# Altium schematic sheet Sheet2.SchDoc
size 594 x 420 mm; PageSetup: Record=PageOptions|CenterHorizontal=True|CenterVertical=True|PrintScale=0.94|XCorrection=1.00|YCorrection=1.00|PrintKind=1|BorderSize=5000000|LeftOffset=0|BottomOffset=0|Orientation=1|PaperLength=1000|PaperWidth=1000|Scale=100|PaperSource=7|PrintQuality=-4|MediaType=1|DitherType=10|PaperKind=A4|PrintScaleMode=1; DecimalNumber: Децимальный номер; HeadOfSector: Нач. сектора; MainDevice: Перв.примен.; Name: Наименование
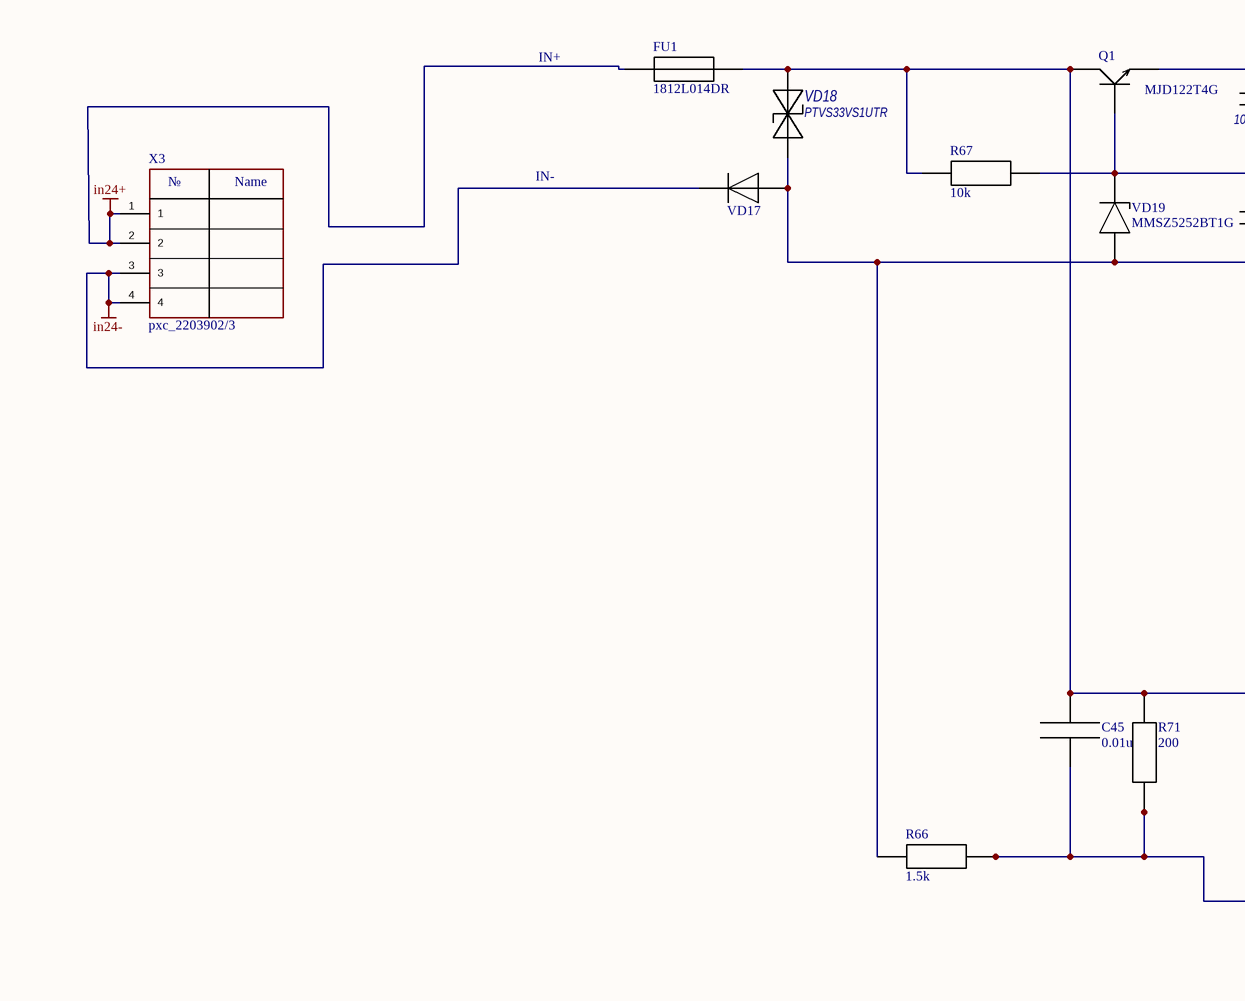
[diagram p0: Sheet2.SchDoc, top left]
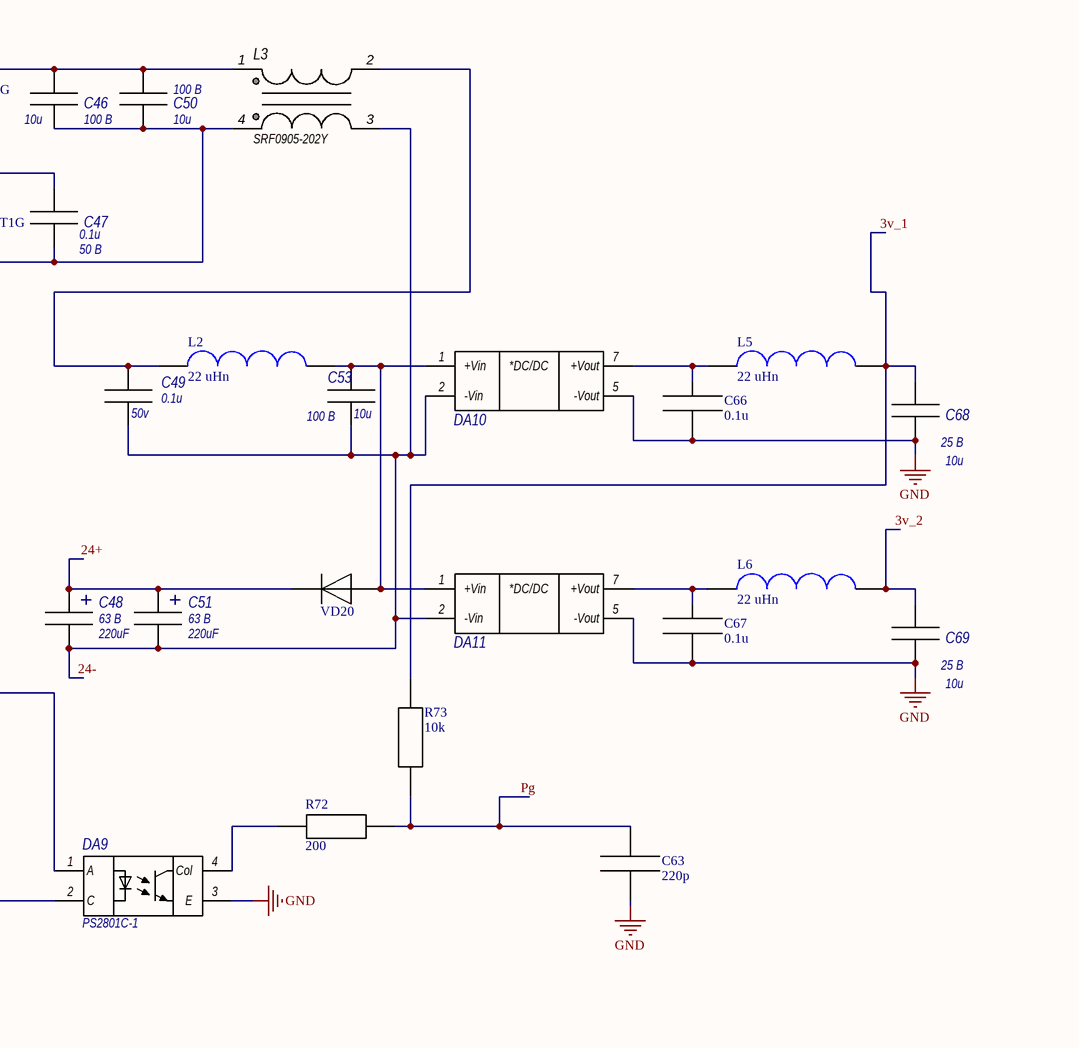
[diagram p1: Sheet2.SchDoc, top right]
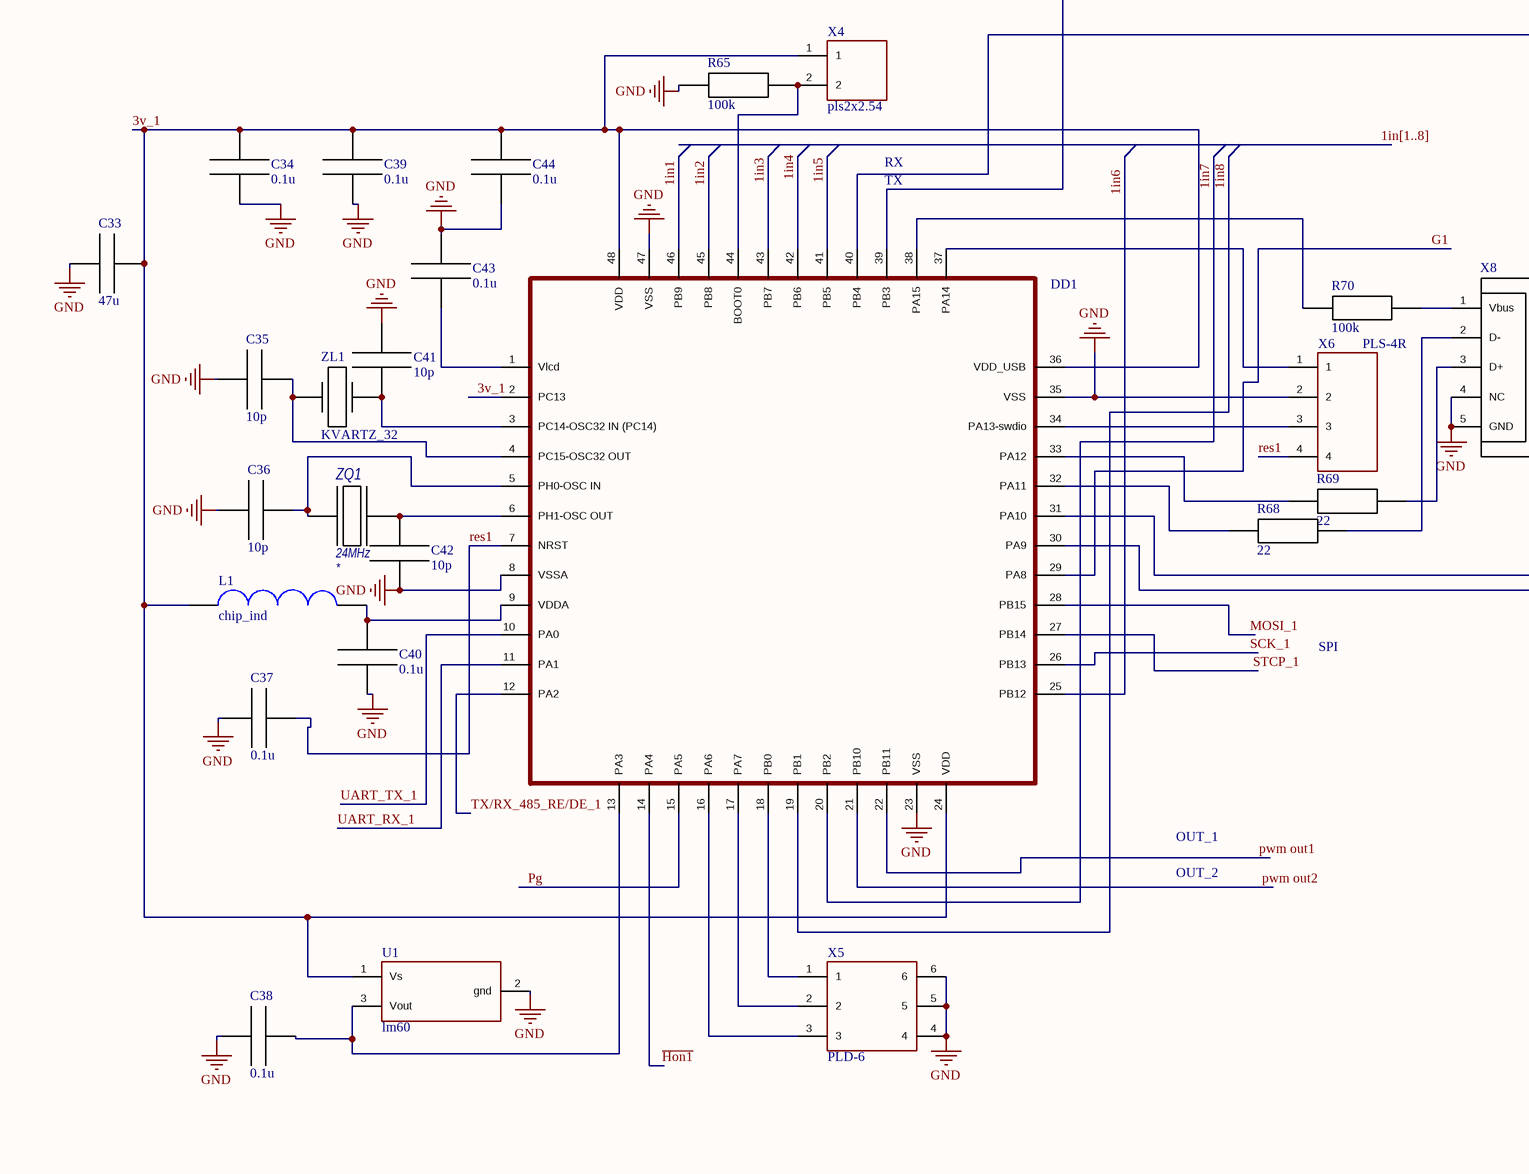
[diagram p2: Sheet2.SchDoc, bottom left]
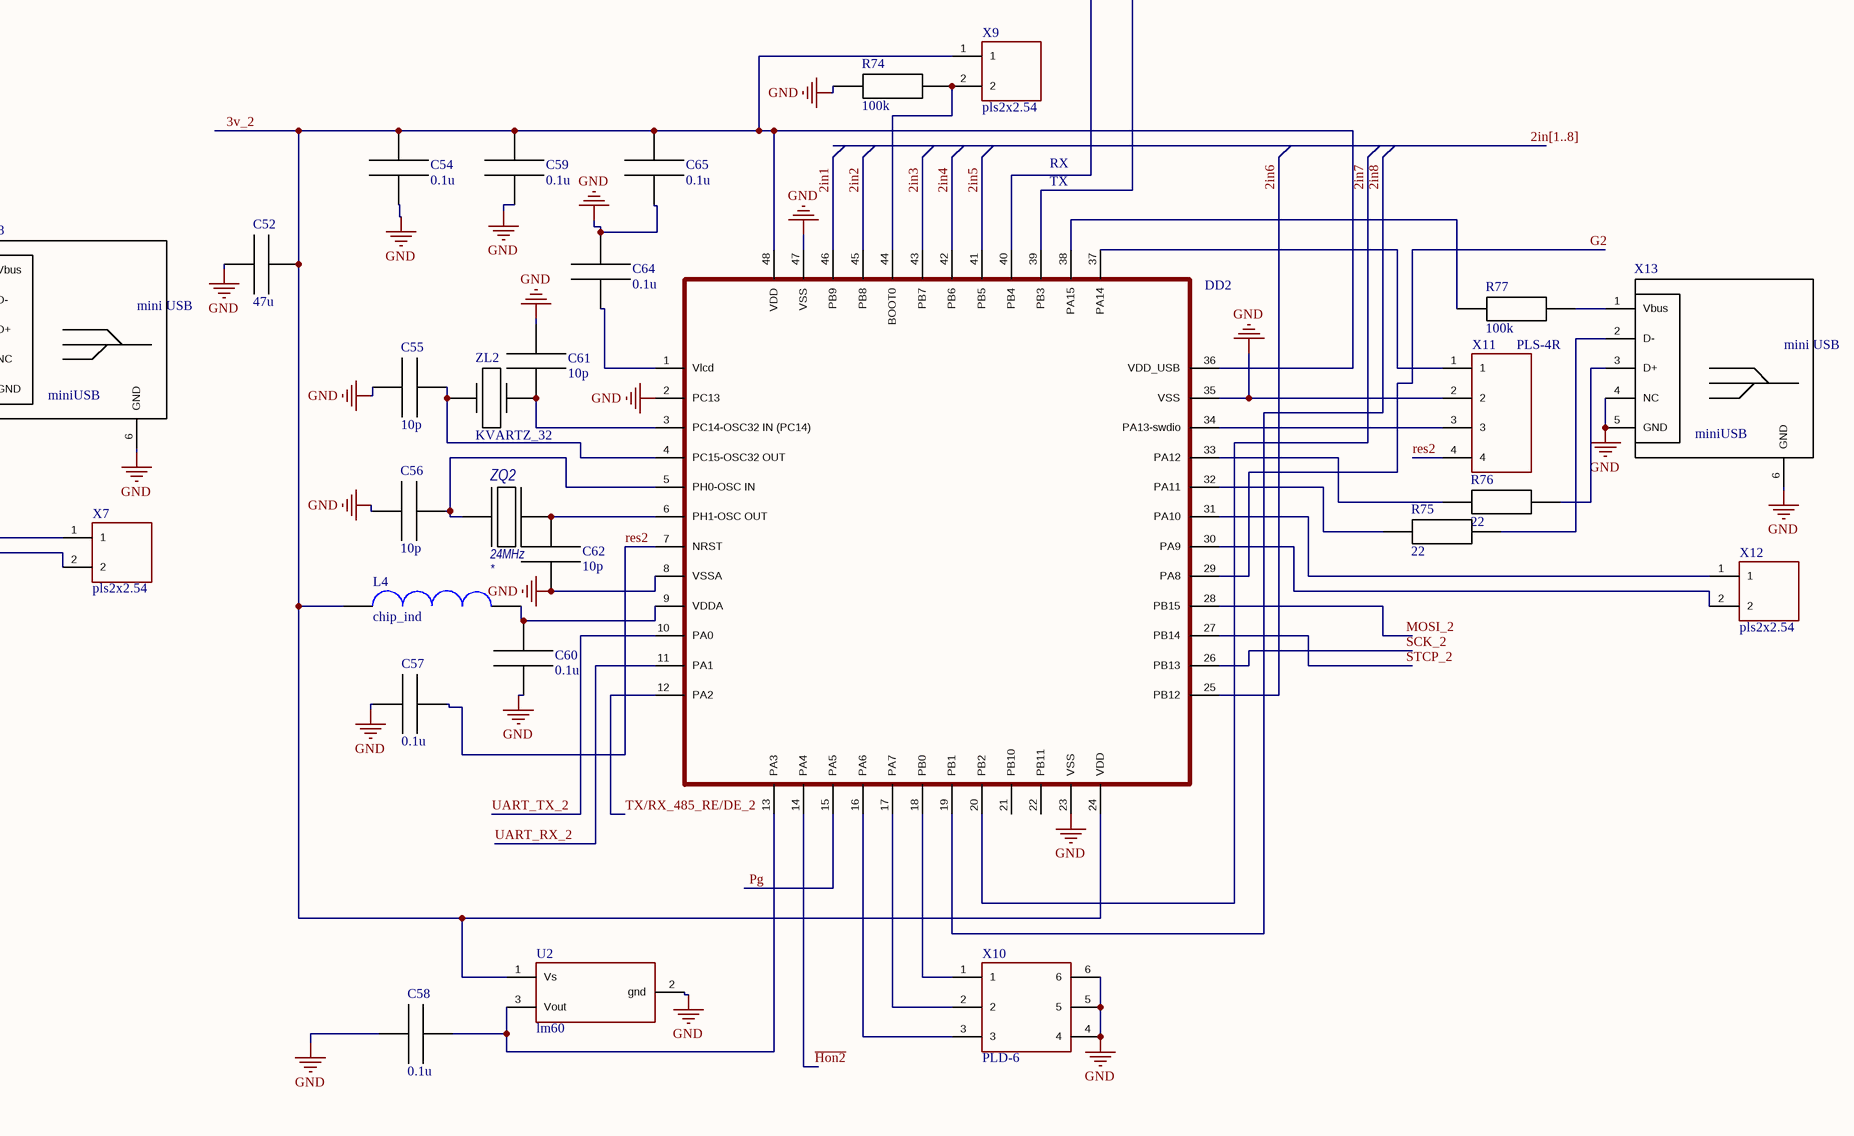
[diagram p3: Sheet2.SchDoc, bottom right]

## Parts
C33  47u  [1206-cap]
C34  0.1u  [cap_0402]
C35  10p  [cap_0402]
C36  10p  [cap_0402]
C37  0.1u  [cap_0402]
C38  0.1u  [cap_0402]
C39  0.1u  [cap_0402]
C40  0.1u  [cap_0402]
C41  10p  [cap_0402]
C42  10p  [cap_0402]
C43  0.1u  [cap_0402]
C44  0.1u  [cap_0402]
C45  0.01u  [0603_cap]
C46  value 10u  Voltage: 100 В  [C1206_]  (hidden comment: 10u 100v)
C47  Voltage: 50 В  [C0603]  (hidden comment: 0.1u)
C48  value 220uF  Voltage: 63 В  [rad_cap_10х12]  (hidden comment: 220u 63v)
C49  Voltage: 50v  [C0603]  (hidden comment: 0.1u)
C50  value 10u  Voltage: 100 В  [C1206_]  (hidden comment: 10u 100v)
C51  value 220uF  Voltage: 63 В  [rad_cap_10х12]  (hidden comment: 220u 63v)
C52  47u  [1206-cap]
C53  value 10u  Voltage: 100 В  [C1206_]  (hidden comment: 10u 100v)
C54  0.1u  [cap_0402]
C55  10p  [cap_0402]
C56  10p  [cap_0402]
C57  0.1u  [cap_0402]
C58  0.1u  [cap_0402]
C59  0.1u  [cap_0402]
C60  0.1u  [cap_0402]
C61  10p  [cap_0402]
C62  10p  [cap_0402]
C63  220p  [cap_0402]
C64  0.1u  [cap_0402]
C65  0.1u  [cap_0402]
C66  0.1u  [cap_0402]
C67  0.1u  [cap_0402]
C68  Voltage: 25 В  [C0603]  (hidden comment: 10u)
C69  Voltage: 25 В  [C0603]  (hidden comment: 10u)
DA9  PS2801C-1  [SSOP-4N]
DA10  AM1D-2403SH30Z  [AM1D-2405]  (value not drawn)
DA11  AM1D-2403SH30Z  [AM1D-2405]  (value not drawn)
DD1  STM32L073CBT6  [LQFP48]  (value not drawn)
DD2  STM32L073CBT6  [LQFP48]  (value not drawn)
FU1  1812L014DR  [fuse1210]
L1  chip_ind  [0603_ind]
L2  22 uHn  [ifsc1515]
L3  value SRF0905-202Y  [SRF0905]  (hidden comment: SRF0905)
L4  chip_ind  [0603_ind]
L5  22 uHn  [ifsc1515]
L6  22 uHn  [ifsc1515]
Q1  MJD122T4G  [sot23]
R65  100k  [res_0402]
R66  1.5k  [2512_res]
R67  10k  [0603_res]
R68  22  [res_0402]
R69  22  [res_0402]
R70  100k  [res_0402]
R71  200  [0603_res]
R72  200  [res_0402]
R73  10k  [res_0402]
R74  100k  [res_0402]
R75  22  [res_0402]
R76  22  [res_0402]
R77  100k  [res_0402]
U1  lm60  [sot23]
U2  lm60  [sot23]
VD17  1N4448W  [SOD-123]  (value not drawn)
VD18  PTVS33VS1UTR  [SOD-123]
VD19  MMSZ5252BT1G  [SOD-123]
VD20  1N4448W  [SOD-123]  (value not drawn)
X3  pxc_2203902/3  [pxc_2203903]
X4  pls2x2.54  [pls2x2.54]
X5  PLD-6  [PLD6]
X6  PLS-4R  [pls-4r]
X7  pls2x2.54  [pls2x2.54]
X8  miniUSB  [miniUSB]
X9  pls2x2.54  [pls2x2.54]
X10  PLD-6  [PLD6]
X11  PLS-4R  [pls-4r]
X12  pls2x2.54  [pls2x2.54]
X13  miniUSB  [miniUSB]
ZL1  KVARTZ_32  [zm206]
ZL2  KVARTZ_32  [zm206]
ZQ1  Type: 24MHz  [ECX-53B-DU]  (hidden comment: ESX-53-DU)
ZQ2  Type: 24MHz  [ECX-53B-DU]  (hidden comment: ESX-53-DU)

## Nets
GND: C33.1 C34.2 C35.1 C36.1 C37.1 C38.1 C39.1 C40.1 C41.2 C42.1 C43.2 C44.1 C52.1 C54.2 C55.1 C56.1 C57.1 C58.1 C59.1 C60.1 C61.2 C62.1 C63.2 C64.2 C65.1 C66.1 C67.1 C68.1 C69.1 DA9.3(E) DA10.5(-Vout) DA11.5(-Vout) DD1.8(VSSA) DD1.23(VSS) DD1.35(VSS) DD1.47(VSS) DD2.2(PC13) DD2.8(VSSA) DD2.23(VSS) DD2.35(VSS) DD2.47(VSS) R65.1 R74.1 U1.2(gnd) U2.2(gnd) X5.4 X5.5 X5.6 X6.2 X8.4(NC) X8.5(GND) X8.6(GND) X10.4 X10.5 X10.6 X11.2 X13.4(NC) X13.5(GND) X13.6(GND) ZQ1.2 ZQ1.4 ZQ2.2 ZQ2.4
in24+: FU1.1 X3.1 X3.2
in24-: VD17.K X3.3 X3.4
1in1: DD1.46(PB9)
1in2: DD1.45(PB8)
1in3: DD1.43(PB7)
1in4: DD1.42(PB6)
1in5: DD1.41(PB5)
1in6: DD1.25(PB12)
1in7: DD1.20(PB2)
1in8: DD1.19(PB1)
2in1: DD2.46(PB9)
2in2: DD2.45(PB8)
2in3: DD2.43(PB7)
2in4: DD2.42(PB6)
2in5: DD2.41(PB5)
2in6: DD2.25(PB12)
2in7: DD2.20(PB2)
2in8: DD2.19(PB1)
3v_1: C33.2 C34.1 C39.2 C44.2 C68.2 DD1.2(PC13) DD1.24(VDD) DD1.36(VDD_USB) DD1.48(VDD) L1.1 L5.2 R73.2 U1.1(Vs) X4.1
3v_2: C52.2 C54.1 C59.2 C65.2 C69.2 DD2.24(VDD) DD2.36(VDD_USB) DD2.48(VDD) L4.1 L6.2 U2.1(Vs) X9.1
24+: C48.1(A) C51.1(A) VD20.K
24-: C48.2(K) C49.1 C51.2(K) C53.1 DA10.2(-Vin) DA11.2(-Vin) L3.3
G1: DD1.29(PA8)
G2: DD2.29(PA8)
~{Hon1}: DD1.14(PA4)
~{Hon2}: DD2.14(PA4)
MOSI_1: DD1.28(PB15)
MOSI_2: DD2.28(PB15)
Pg: C63.1 DD1.15(PA5) DD2.15(PA5) R72.2 R73.1
pwm out1: DD1.22(PB11)
pwm out2: DD1.21(PB10)
res1: C37.2 DD1.7(NRST) X6.4
res2: C57.2 DD2.7(NRST) X11.4
SCK_1: DD1.26(PB13)
SCK_2: DD2.26(PB13)
STCP_1: DD1.27(PB14)
STCP_2: DD2.27(PB14)
TX/RX_485_RE/DE_1: DD1.12(PA2)
TX/RX_485_RE/DE_2: DD2.12(PA2)
UART_RX_1: DD1.11(PA1)
UART_RX_2: DD2.11(PA1)
UART_TX_1: DD1.10(PA0)
UART_TX_2: DD2.10(PA0)
NetC35_2: C35.2 DD1.4(PC15-OSC32_OUT) ZL1.2
NetC36_2: C36.2 DD1.5(PH0-OSC_IN) ZQ1.1
NetC38_2: C38.2 DD1.13(PA3) U1.3(Vout)
NetC40_2: C40.2 DD1.9(VDDA) L1.2
NetC41_1: C41.1 DD1.3(PC14-OSC32_IN_(PC14)) ZL1.1
NetC42_2: C42.2 DD1.6(PH1-OSC_OUT) ZQ1.3
NetC43_1: C43.1 DD1.1(Vlcd)
NetC45_1: C45.1 DA9.2(C) R66.2 R71.1
NetC45_2: C45.2 DA9.1(A) FU1.2 Q1.2(K) R67.1 R71.2 VD18.K
NetC46_1: C46.1 C47.1 C50.1 L3.4 R66.1 VD17.A VD18.A VD19.A
NetC46_2: C46.2 C50.2 L3.1 Q1.3(E)
NetC47_2: C47.2 Q1.1(B) R67.2 VD19.K
NetC49_2: C49.2 L2.1 L3.2
NetC53_2: C53.2 DA10.1(+Vin) DA11.1(+Vin) L2.2 VD20.A
NetC55_2: C55.2 DD2.4(PC15-OSC32_OUT) ZL2.2
NetC56_2: C56.2 DD2.5(PH0-OSC_IN) ZQ2.1
NetC58_2: C58.2 DD2.13(PA3) U2.3(Vout)
NetC60_2: C60.2 DD2.9(VDDA) L4.2
NetC61_1: C61.1 DD2.3(PC14-OSC32_IN_(PC14)) ZL2.1
NetC62_2: C62.2 DD2.6(PH1-OSC_OUT) ZQ2.3
NetC64_1: C64.1 DD2.1(Vlcd)
NetC66_2: C66.2 DA10.7(+Vout) L5.1
NetC67_2: C67.2 DA11.7(+Vout) L6.1
NetDA9_4: DA9.4(Col) R72.1
NetDD1_16: DD1.16(PA6) X5.3
NetDD1_17: DD1.17(PA7) X5.2
NetDD1_18: DD1.18(PB0) X5.1
NetDD1_30: DD1.30(PA9) X7.2
NetDD1_31: DD1.31(PA10) X7.1
NetDD1_32: DD1.32(PA11) R68.1
NetDD1_33: DD1.33(PA12) R69.1
NetDD1_34: DD1.34(PA13-swdio) X6.3
NetDD1_37: DD1.37(PA14) X6.1
NetDD1_38: DD1.38(PA15) R70.1
NetDD1_39: DD1.39(PB3) DD2.40(PB4)
NetDD1_40: DD1.40(PB4) DD2.39(PB3)
NetDD1_44: DD1.44(BOOT0) R65.2 X4.2
NetDD2_16: DD2.16(PA6) X10.3
NetDD2_17: DD2.17(PA7) X10.2
NetDD2_18: DD2.18(PB0) X10.1
NetDD2_30: DD2.30(PA9) X12.2
NetDD2_31: DD2.31(PA10) X12.1
NetDD2_32: DD2.32(PA11) R75.1
NetDD2_33: DD2.33(PA12) R76.1
NetDD2_34: DD2.34(PA13-swdio) X11.3
NetDD2_37: DD2.37(PA14) X11.1
NetDD2_38: DD2.38(PA15) R77.1
NetDD2_44: DD2.44(BOOT0) R74.2 X9.2
NetR68_2: R68.2 X8.2(D-)
NetR69_2: R69.2 X8.3(D+)
NetR70_2: R70.2 X8.1(Vbus)
NetR75_2: R75.2 X13.2(D-)
NetR76_2: R76.2 X13.3(D+)
NetR77_2: R77.2 X13.1(Vbus)

Not connected (* = marked no-connect by the designer): DD2 21(PB10) 22(PB11)

## Buses and harness runs
bus 1in[1..8]
bus 2in[1..8]

## Notes on the sheet
- IN+
- IN-
- TX
- RX
- SPI
- OUT_1
- OUT_2
- Подп. и дата
- Инв.№ дубл.
- Взам.инв.№
- Подп.и дата
- Инв.№ подл.
- Изм.
- Лист
- № докум.
- Подп.
- Дата
- Формат  A2
- (in symbol AM1D-2405SH30Z) *DC/DC
- (in symbol Capacitor electrolytic) +
- (in symbol miniUSB) mini USB
- (in symbol pxc_2203902/3) №; Name

## Library data of the parts
C33-C45 C52 C54-C67 = cap
C46 C50 C53 = Capacitor ceramic: Capacitance: 10u x 100 В; Dielectric: *; Tolerance: *
C47 = Capacitor ceramic: Capacitance: 0.1u x 50 В; Dielectric: *; Tolerance: *; Value: 0.1u
C48 = Capacitor electrolytic: Tolerance: ±20%; Polarization: Polar; Capacitance: 220uF x 63 В; Famile: Capacitor; Category: Capacitors; Operating Temperature: -40°C ~ 105°C; Package / Case: Radial, Can - SMD; ComponentLink1Description: Параметры; ComponentLink1URL: 5\res\Справочники\Конденсаторы\KEM_A4003_EXV.pdf; Dielectric: 63v
C49 = Capacitor ceramic: Capacitance: 0.1u x 50v; Dielectric: *; Tolerance: *; Value: 0.1u
C51 = Capacitor electrolytic: 10x12; Tolerance: ±20%; Polarization: Polar; Capacitance: 220uF x 63 В; Famile: Capacitor; Category: Capacitors; Operating Temperature: -40°C ~ 105°C; Package / Case: Radial, Can - SMD; ComponentLink1Description: Параметры; ComponentLink1URL: 5\res\Справочники\Конденсаторы\KEM_A4003_EXV.pdf; Dielectric: 63v
C68 C69 = Capacitor ceramic: Capacitance: 10u x 25 В; Dielectric: *; Tolerance: *; Value: 10u
DA10 DA11 = AM1D-2405SH30Z: AM1D-2403SH30Z 21.6-26.4V 3.3V 200mA 3000V 54мА 6мА 220мкF 77%
FU1 = fuse
L1 L4 = ind
L2 L5 L6 = ind_b82477g4
Q1 = npn
R65-R77 = res
VD17 VD20 = 1N4448
VD18 = PTVS33VS1UTR: PTVS33VS1UTR,115, TVS DIODE 33VWM 53.3VC SOD123W; Type: PTVS33VS1UTR
VD19 = stab: MMSZ5252BT1G, Стабилитрон 0.5Вт 24В
ZQ1 ZQ2 = REZONATOR: Crystal; Value: *
DA9 = PS2801C-1: Type: PS2801C-1